# EAGLE schematic Flight Computer (EAGLE 9.4.2)
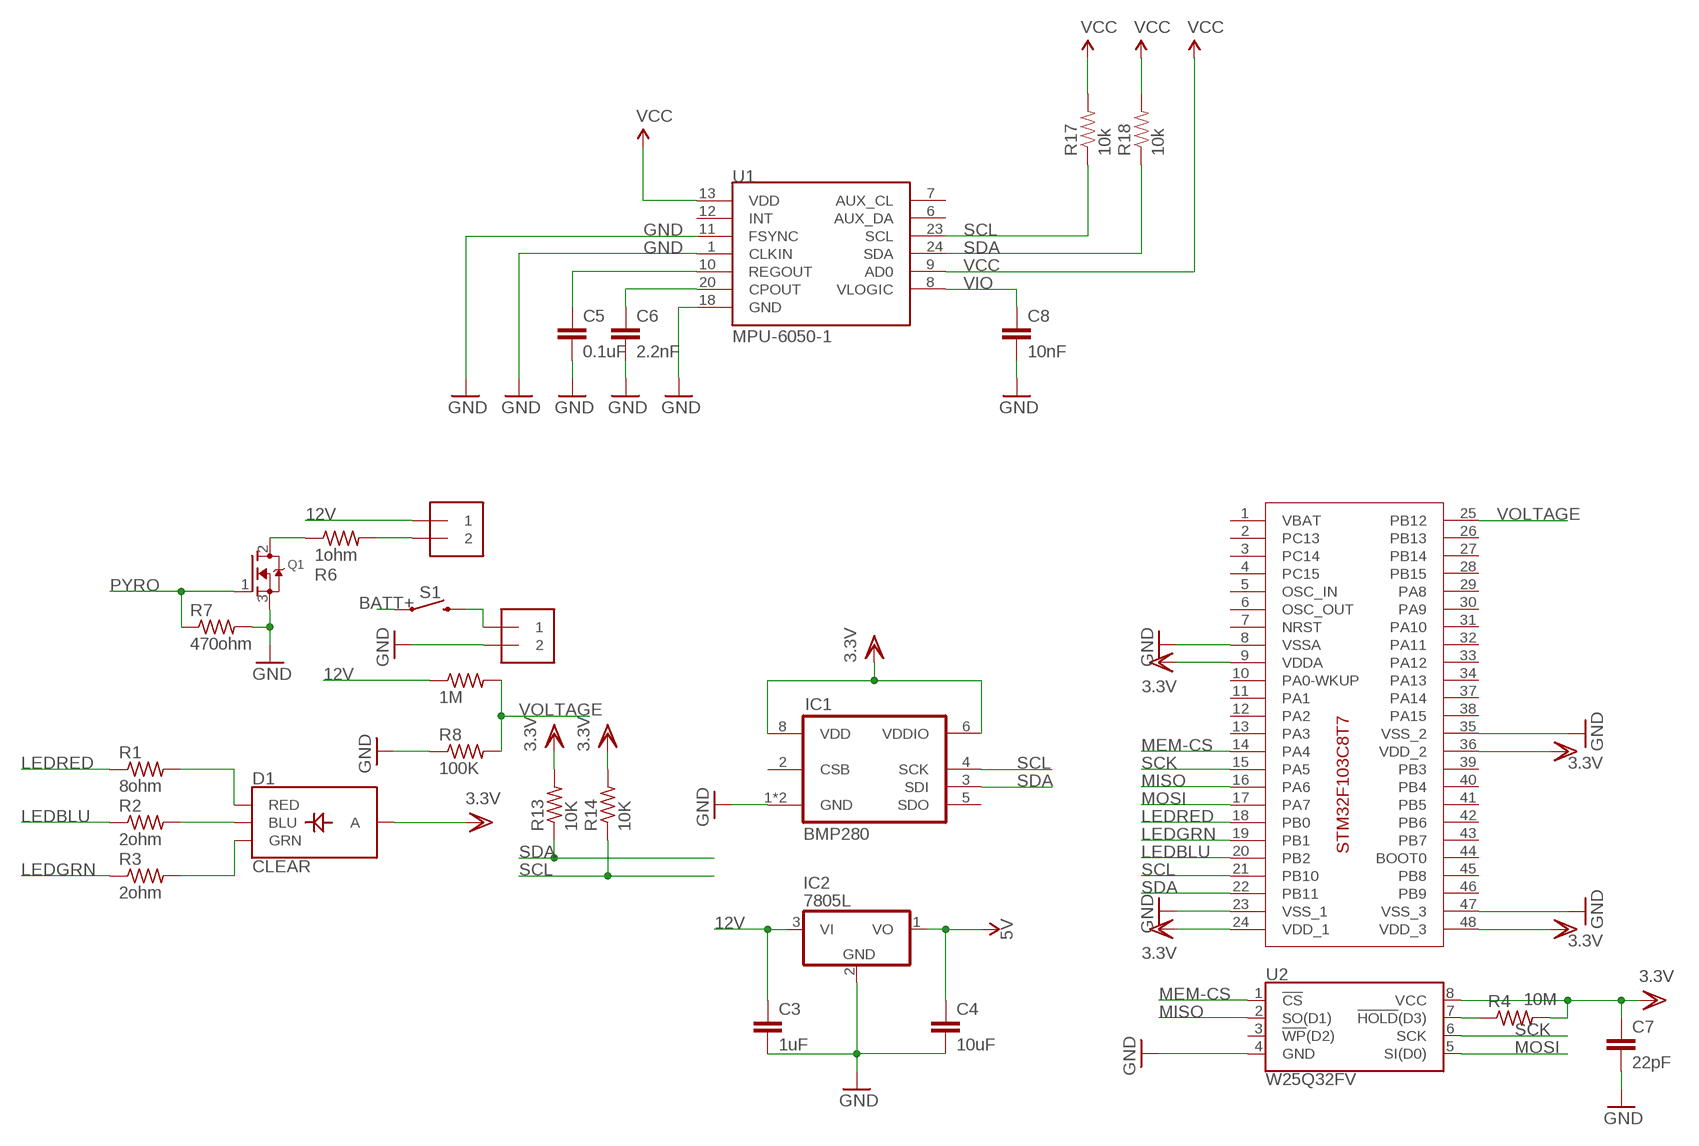
[diagram p0: schematic, sheet 1]

## Parts
C3  1uF  C2,5-3  [C2.5-3]
C4  10uF  C2,5-3  [C2.5-3]
C5  0.1uF  CAP0603-CAP  [0603-CAP]
C6  2.2nF  CAP0603-CAP  [0603-CAP]
C7  22pF  C2,5-3  [C2.5-3]
C8  10nF  CAP0603-CAP  [0603-CAP]
D1  CLEAR  LED-RGB-CACLEAR  [LED-RGB-THRU]
IC1  BMP280  [BMP280]
IC2  7805L  [TO92]
J1  1X2-3.5MM  [1X2-3.5MM]
J6  1X2-3.5MM  [1X2-3.5MM]
Q1  MOSFET-NGDS_TO220V  [TO220V]
R1  8ohm  R-US_0204/2V  [0204V]
R2  2ohm  R-US_0204/2V  [0204V]
R3  2ohm  R-US_0204/2V  [0204V]
R4  10M  R-US_0204/2V  [0204V]
R5  1M  R-US_0204/2V  [0204V]
R6  1ohm  R-US_0204/2V  [0204V]
R7  470ohm  R-US_0204/2V  [0204V]
R8  100K  R-US_0204/2V  [0204V]
R13  10K  R-US_0204/2V  [0204V]
R14  10K  R-US_0204/2V  [0204V]
R17  10k  RESISTOR0603-RES  [0603-RES]
R18  10k  RESISTOR0603-RES  [0603-RES]
S1  MOMENTARY-SWITCH-SPST-SMD-5.2-REDUNDANT  [TACTILE_SWITCH_SMD_5.2MM]
U1  MPU-6050-1  [QFN-24-4MM2]
U2  W25Q32FV  W25Q32FVSS  [SOIC-8]
U$1  STM32F103C8T7  [STM32F103C8T7]

## Nets
5V: C4.1 IC2.1(VO)
12V: C3.1 IC2.3(VI) J6.1 R5.1
BATT+: S1.1 S1.2
GND: C3.2 C4.2 C5.2 C6.2 C7.2 C8.2 IC1.1(GND) IC1.7(GND) IC2.2(GND) J1.2 Q1.3(S) R7.2 R8.1 U1.1(CLKIN) U1.11(FSYNC) U1.18(GND) U2.4(GND) U$1.8(VSSA) U$1.23(VSS_1) U$1.35(VSS_2) U$1.47(VSS_3)
LEDBLU: R2.1 U$1.20(PB2)
LEDGRN: R3.1 U$1.19(PB1)
LEDRED: R1.1 U$1.18(PB0)
MEM-CS: U2.1(!CS!) U$1.14(PA4)
MISO: U2.2(SO(D1)) U$1.16(PA6)
MOSI: U2.5(SI(D0)) U$1.17(PA7)
N$1: D1.1(RED) R1.2
N$2: D1.3(GRN) R3.2
N$3: D1.4(BLU) R2.2
N$4: J6.2 R6.2
N$5: R4.1 U2.7(!HOLD!(D3))
N$6: Q1.2(D) R6.1
N$11: C6.1 U1.20(CPOUT)
N$12: C5.1 U1.10(REGOUT)
N$15: J1.1 S1.3 S1.4
PYRO: Q1.1(G) R7.1
SCK: U2.6(SCK) U$1.15(PA5)
SCL: IC1.4(SCK) R14.1 R17.1 U1.23(SCL) U$1.21(PB10)
SDA: IC1.3(SDI) R13.1 R18.1 U1.24(SDA) U$1.22(PB11)
VCC: R17.2 R18.2 U1.9(AD0) U1.13(VDD)
VDD: C7.1 D1.2(A) IC1.6(VDDIO) IC1.8(VDD) R4.2 R13.2 R14.2 U2.8(VCC) U$1.9(VDDA) U$1.24(VDD_1) U$1.36(VDD_2) U$1.48(VDD_3) ; supply symbol labelled 3.3V
VIO: C8.1 U1.8(VLOGIC)
VOLTAGE: R5.2 R8.2 U$1.25(PB12)
Unconnected: IC1.2(CSB) IC1.5(SDO) U1.6(AUX_DA) U1.7(AUX_CL) U1.12(INT) U2.3(!WP!(D2)) U$1.1(VBAT) U$1.2(PC13) U$1.3(PC14) U$1.4(PC15) U$1.5(OSC_IN) U$1.6(OSC_OUT) U$1.7(NRST) U$1.10(PA0-WKUP) U$1.11(PA1) U$1.12(PA2) U$1.13(PA3) U$1.26(PB13) U$1.27(PB14) U$1.28(PB15) U$1.29(PA8) U$1.30(PA9) U$1.31(PA10) U$1.32(PA11) U$1.33(PA12) U$1.34(PA13) U$1.37(PA14) U$1.38(PA15) U$1.39(PB3) U$1.40(PB4) U$1.41(PB5) U$1.42(PB6) U$1.43(PB7) U$1.44(BOOT0) U$1.45(PB8) U$1.46(PB9)

## Library data of the parts
C3 C4 C7 = capacitor-wima:C: CAPACITOR naming: grid - package width
C5 C6 C8 = SparkFun:CAP: Capacitor Standard 0603 ceramic capacitor, and 0.1" leaded capacitor.
D1 = SparkFun-LED:LED-RGB-CA: LED-RGB Diffused Common Anode Packages: LED RGB-THRU P-LCC-4-3 LED-TRICOLOR-SMD SparkFun Products: RGB Diffused Common Anode- Diffuse <[https://www.sparkfun.com/products/10821]> RGB Diffused Common Anode - Clear <[https://www.sparkfun.com/products/10820]> Qduino Mini <[https://www.sparkfun.com/products/13614]> Triple Output LED RGB - SMD <https://www.sparkfun.com/products/7844>; PROD_ID: DIO-10631
IC1 = bosch-bmp280:BMP280: The BMP280 is an absolute barometric pressure sensor especially designed for mobile applications. The sensor module is housed in an extremely compact 8-pin metal-lid LGA package with a footprint of only 2.0 × 2.5 mm2 and 0.95 mm package height. Its small dimensions and its low power consumption of 2.7 μA @1Hz allow the implementation in battery driven devices such as mobile phones, GPS modules or watches. The library has been designed by Richard Magdycz <https://www.facebook.com/groups/eaglecadsoftUK>
IC2 = adafruit:78*: Positive VOLTAGE REGULATOR Added bigger pads to the TO-92 package
J1 J6 = adafruit:1X2: 3.5mm Terminal block http://www.ladyada.net/library/pcb/eaglelibrary.html
Q1 = adafruit:MOSFET-N: N-Channel Mosfet 2N7002E - 60V 260mA SOT23 [Digikey: 2N7002ET1GOSTR-ND] - REEL BSH103 - 30V 850mA SOT23 [Digikey: 568-5013-1-ND]
R1-R8 = adafruit:R-US_: RESISTOR, American symbol
R13 R14 = rcl:R-US_: RESISTOR, American symbol; SPICEPREFIX: R
R17 R18 = SparkFun:RESISTOR: Resistor Basic schematic elements and footprints for 0603, 1206, and PTH resistors.
S1 = SparkFun-Switches:MOMENTARY-SWITCH-SPST: Momentary Switch (Pushbutton) - SPST Normally-open (NO) SPST momentary switches (buttons, pushbuttons). Variants PTH-12MM - 12mm square, through-hole Momentary Pushbutton Switch - 12mm Square <https://www.sparkfun.com/products/9190> (COM-09190) PTH-6.0MM, PTH-6.0MM-KIT - 6.0mm square, through-hole Mini Pushbutton Switch <https://www.sparkfun.com/products/97> (COM-00097) KIT package intended for soldering kit's - only one side of pads' copper is exposed. PTH-RIGHT-ANGLE-KIT - Right-angle, through-hole Right Angle Tactile Button <https://www.sparkfun.com/products/10791> - Used on SparkFun BigTime Watch Kit <https://www.sparkfun.com/products/11734> SMD-12MM - 12mm square, surface-mount Tactile Button - SMD (12mm) <https://www.sparkfun.com/products/12993> (COM-12993) Used on SparkFun PicoBoard <https://www.sparkfun.com/products/11888> SMD-4.5MM - 4.5mm Square Trackball Switch Used on SparkFun Blackberry Trackballer Breakout <https://www.sparkfun.com/products/13169> SMD-4.6MMX2.8MM - 4.60mm x 2.80mm, surface mount Used on SparkFun SAMD21 Mini Breakout <https://www.sparkfun.com/products/13664> SMD-5.2MM, SMD-5.2-REDUNDANT - 5.2mm square, surface-mount Mini Pushbutton Switch - SMD <https://www.sparkfun.com/products/8720> (COM-08720) Used on Arduino Pro Mini <https://www.sparkfun.com/products/11114> REDUNDANT package connects both switch circuits together SMD-6.0X3.5MM - 6.0 x 3.5mm, surface mount Momentary Reset Switch SMD <https://www.sparkfun.com/products/8229> (COM-08229) SMD-6.2MM-TALL - 6.2mm square, surface mount Tactile Button - SMD (6mm) <https://www.sparkfun.com/products/12992> Used on SparkFun Digital Sandbox <https://www.sparkfun.com/products/12651> SMD-RIGHT-ANGLE - Right-angle, surface mount Used on SparkFun Block for Intel® Edison - Arduino <https://www.sparkfun.com/products/13036>; PROD_ID: SWCH-08247; SF_SKU: COM-08720
U1 = Testing:MPU-6050
U2 = SparkFun-IC-Memory:W25Q32FV: W25Q32FV 32Mb (4MB) Serial Flash Memory The W25Q32FV support the standard Serial Peripheral Interface (SPI), Dual/Quad I/O SPI as well as 2-clocks instruction cycle Quad Peripheral Interface (QPI). 104MHz, SPI, 8-SOIC-EIAJ Datasheet <http://www.winbond.com/resource-files/w25q32fv%20revh%20091613.pdf> SparkFun Products SparkFun Blynk Board - ESP8266 <https://www.sparkfun.com/products/13794> (WRL-13794); PROD_ID: IC-13229
U$1 = STM32F103C8T7:STM32F103C8T7: STM32F103C8T7 ARM 32-BIT 72Hz 64KB MCU

## Net classes
0 Default: width 0.203 mm